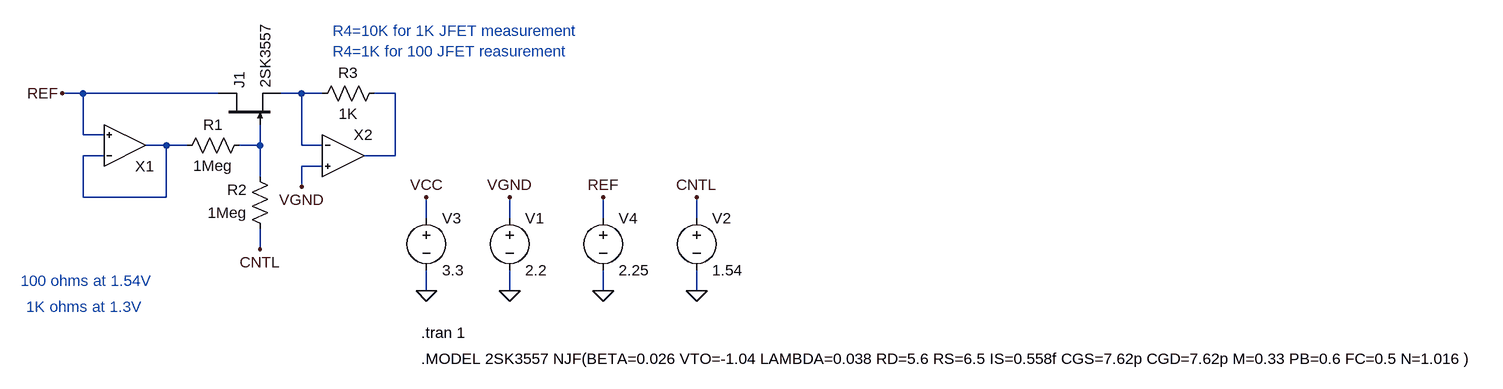
[diagram p0: schematic test_calibrate_jfet.asc]
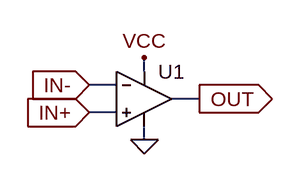
[diagram p1: sub-circuit opamp.asc]
test_calibrate_jfet.asc, the LTspice schematic file:
Version 4
SHEET 1 2200 680
WIRE -48 0 -80 0
WIRE 160 0 -48 0
WIRE 288 0 256 0
WIRE 320 0 288 0
WIRE 432 0 400 0
WIRE -48 64 -48 0
WIRE -16 64 -48 64
WIRE 80 80 48 80
WIRE 112 80 80 80
WIRE 224 80 224 48
WIRE 224 80 192 80
WIRE 288 80 288 0
WIRE 320 80 288 80
WIRE -16 96 -48 96
WIRE 432 96 432 0
WIRE 432 96 384 96
WIRE 320 112 288 112
WIRE 224 128 224 80
WIRE 288 144 288 112
WIRE -48 160 -48 96
WIRE 80 160 80 80
WIRE 80 160 -48 160
WIRE 480 192 480 160
WIRE 608 192 608 160
WIRE 752 192 752 160
WIRE 896 192 896 160
WIRE 224 240 224 208
WIRE 480 304 480 272
WIRE 608 304 608 272
WIRE 752 304 752 272
WIRE 896 304 896 272
FLAG 288 144 VGND
FLAG 224 240 CNTL
FLAG 608 304 0
FLAG 608 160 VGND
FLAG 896 304 0
FLAG 896 160 CNTL
FLAG 480 304 0
FLAG 480 160 VCC
FLAG -80 0 REF
FLAG 752 304 0
FLAG 752 160 REF
SYMBOL njf 160 48 R270
SYMATTR InstName J1
SYMATTR Value 2SK3557
SYMBOL opamp 16 80 M180
SYMATTR InstName X1
SYMBOL voltage 608 176 R0
WINDOW 123 0 0 Left 0
WINDOW 39 0 0 Left 0
SYMATTR InstName V1
SYMATTR Value 2.2
SYMBOL voltage 896 176 R0
WINDOW 123 0 0 Left 0
WINDOW 39 0 0 Left 0
SYMATTR InstName V2
SYMATTR Value 1.54
SYMBOL voltage 480 176 R0
WINDOW 123 0 0 Left 0
WINDOW 39 0 0 Left 0
SYMATTR InstName V3
SYMATTR Value 3.3
SYMBOL opamp 352 96 R0
SYMATTR InstName X2
SYMBOL voltage 752 176 R0
WINDOW 123 0 0 Left 0
WINDOW 39 0 0 Left 0
SYMATTR InstName V4
SYMATTR Value 2.25
SYMBOL res 416 -16 R90
WINDOW 0 0 56 VBottom 2
WINDOW 3 32 56 VTop 2
SYMATTR InstName R3
SYMATTR Value 1K
SYMBOL res 240 224 R180
WINDOW 0 36 76 Left 2
WINDOW 3 36 40 Left 2
SYMATTR InstName R2
SYMATTR Value 1Meg
SYMBOL res 208 64 R90
WINDOW 0 0 56 VBottom 2
WINDOW 3 32 56 VTop 2
SYMATTR InstName R1
SYMATTR Value 1Meg
TEXT 472 368 Left 2 !.tran 1
TEXT -144 288 Left 2 ;100 ohms at 1.54V
TEXT -136 328 Left 2 ;1K ohms at 1.3V
TEXT 336 -96 Left 2 ;R4=10K for 1K JFET measurement\nR4=1K for 100 JFET reasurement
TEXT 472 408 Left 2 !.MODEL 2SK3557 NJF(BETA=0.026 VTO=-1.04 LAMBDA=0.038 RD=5.6 RS=6.5 IS=0.558f CGS=7.62p CGD=7.62p M=0.33 PB=0.6 FC=0.5 N=1.016 )

opamp.asc, the sub-circuit schematic file:
Version 4
SHEET 1 880 680
WIRE 144 144 144 128
WIRE 112 160 80 160
WIRE 208 176 176 176
WIRE 112 192 80 192
WIRE 144 224 144 208
FLAG 144 224 0
FLAG 144 128 VCC
FLAG 208 176 OUT
IOPIN 208 176 Out
FLAG 80 192 IN+
IOPIN 80 192 In
FLAG 80 160 IN-
IOPIN 80 160 In
SYMBOL Opamps\\UniversalOpamp2 144 176 R0
SYMATTR InstName U1
SYMATTR Value2 Avol=1Meg GBW=1.2Meg Slew=10Meg

The netlist it stands for:
* test_calibrate_jfet.asc
J1 REF N004 N001 2SK3557
XX1 REF N003 N003 opamp
V1 VGND 0 2.2
V2 CNTL 0 1.54
V3 VCC 0 3.3
XX2 VGND N001 N002 opamp
V4 REF 0 2.25
R3 N002 N001 1K
R2 CNTL N004 1Meg
R1 N004 N003 1Meg

* block symbol definitions
.subckt opamp IN+ IN- OUT
XU1 IN+ IN- VCC 0 OUT level.2 Avol=1Meg GBW=1.2Meg Slew=10Meg ilimit=25m rail=0 Vos=0 phimargin=45 en=0 enk=0 in=0 ink=0 Rin=500Meg  ; pins IN+ IN- V+ V- OUT
.ends opamp

.model NJF NJF
.model PJF PJF
.lib standard.jft
.tran 1
* 100 ohms at 1.54V
* 1K ohms at 1.3V
* R4=10K for 1K JFET measurement
* R4=1K for 100 JFET reasurement
.MODEL 2SK3557 NJF(BETA=0.026 VTO=-1.04 LAMBDA=0.038 RD=5.6 RS=6.5 IS=0.558f CGS=7.62p CGD=7.62p M=0.33 PB=0.6 FC=0.5 N=1.016 )
.lib UniversalOpamps2.sub
.backanno
.end